# EAGLE design Battery Monitor_V2 (EAGLE 5.07)
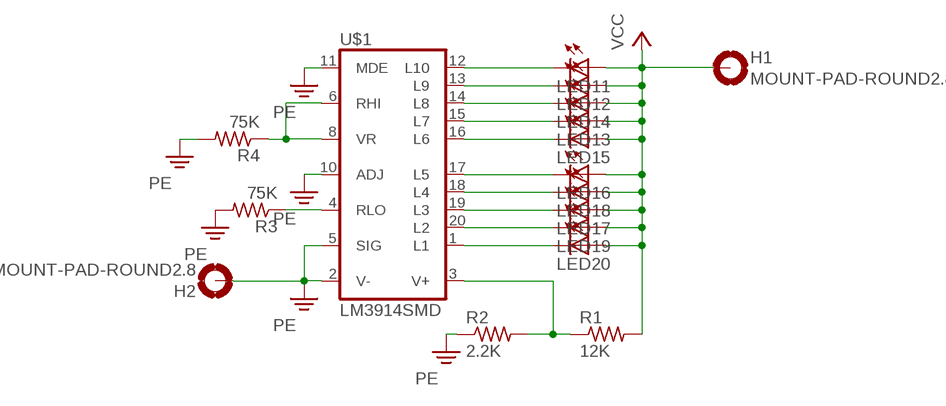
[diagram p0: schematic, sheet 1]

## Parts
H1  MOUNT-PAD-ROUND2.8  [2,8-PAD]
H2  MOUNT-PAD-ROUND2.8  [2,8-PAD]
LED11  LEDCHIP-LED0603  [CHIP-LED0603]
LED12  LEDCHIP-LED0603  [CHIP-LED0603]
LED13  LEDCHIP-LED0603  [CHIP-LED0603]
LED14  LEDCHIP-LED0603  [CHIP-LED0603]
LED15  LEDCHIP-LED0603  [CHIP-LED0603]
LED16  LEDCHIP-LED0603  [CHIP-LED0603]
LED17  LEDCHIP-LED0603  [CHIP-LED0603]
LED18  LEDCHIP-LED0603  [CHIP-LED0603]
LED19  LEDCHIP-LED0603  [CHIP-LED0603]
LED20  LEDCHIP-LED0603  [CHIP-LED0603]
R1  12K  R-US_R0805  [R0805]
R2  2.2K  R-US_R0805  [R0805]
R3  75K  R-US_R0805  [R0805]
R4  75K  R-US_R0805  [R0805]
U$1  LM3914SMD  [PLCC20S]

## Nets
N$1: R1.1 R2.2 U$1.3(V+)
N$2: LED11.C U$1.12(L10)
N$3: LED12.C U$1.13(L9)
N$4: LED14.C U$1.14(L8)
N$5: LED13.C U$1.15(L7)
N$7: LED15.C U$1.16(L6)
N$8: LED16.C U$1.17(L5)
N$9: LED18.C U$1.18(L4)
N$10: LED17.C U$1.19(L3)
N$11: LED19.C U$1.20(L2)
N$12: LED20.C U$1.1(L1)
N$14: R3.1 U$1.4(RLO)
N$15: R4.1 U$1.6(RHI) U$1.8(VR)
PE: H2.B2,8(MOUNT) R2.1 R3.2 R4.2 U$1.2(V-) U$1.5(SIG) U$1.10(ADJ) U$1.11(MDE)
VCC: H1.B2,8(MOUNT) LED11.A LED12.A LED13.A LED14.A LED15.A LED16.A LED17.A LED18.A LED19.A LED20.A R1.2

## Library data of the parts
H1 H2 = holes:MOUNT-PAD-ROUND: MOUNTING PAD, round
LED11-LED20 = led:LED: LED OSRAM: - CHIPLED LG R971, LG N971, LY N971, LG Q971, LY Q971, LO R971, LY R971 LH N974, LH R974 LS Q976, LO Q976, LY Q976 LO Q996 - Hyper CHIPLED LW Q18S LB Q993, LB Q99A, LB R99A - SideLED LS A670, LO A670, LY A670, LG A670, LP A670 LB A673, LV A673, LT A673, LW A673 LH A674 LY A675 LS A676, LA A676, LO A676, LY A676, LW A676 LS A679, LY A679, LG A679 - Hyper Micro SIDELED® LS Y876, LA Y876, LO Y876, LY Y876 LT Y87S - SmartLED LW L88C, LW L88S LB L89C, LB L89S, LG L890 LS L89K, LO L89K, LY L89K LS L896, LA L896, LO L896, LY L896 - TOPLED LS T670, LO T670, LY T670, LG T670, LP T670 LSG T670, LSP T670, LSY T670, LOP T670, LYG T670 LG T671, LOG T671, LSG T671 LB T673, LV T673, LT T673, LW T673 LH T674 LS T676, LA T676, LO T676, LY T676, LB T676, LH T676, LSB T676, LW T676 LB T67C, LV T67C, LT T67C, LS T67K, LO T67K, LY T67K, LW E67C LS E67B, LA E67B, LO E67B, LY E67B, LB E67C, LV E67C, LT E67C LW T67C LS T679, LY T679, LG T679 LS T770, LO T770, LY T770, LG T770, LP T770 LB T773, LV T773, LT T773, LW T773 LH T774 LS E675, LA E675, LY E675, LS T675 LS T776, LA T776, LO T776, LY T776, LB T776 LHGB T686 LT T68C, LB T68C - Hyper Mini TOPLED® LB M676 - Mini TOPLED Santana® LG M470 LS M47K, LO M47K, LY M47K Source: http://www.osram.convergy.de LUXEON: - LUMILED® LXK2-PW12-R00, LXK2-PW12-S00, LXK2-PW14-U00, LXK2-PW14-V00 LXK2-PM12-R00, LXK2-PM12-S00, LXK2-PM14-U00 LXK2-PE12-Q00, LXK2-PE12-R00, LXK2-PE12-S00, LXK2-PE14-T00, LXK2-PE14-U00 LXK2-PB12-K00, LXK2-PB12-L00, LXK2-PB12-M00, LXK2-PB14-N00, LXK2-PB14-P00, LXK2-PB14-Q00 LXK2-PR12-L00, LXK2-PR12-M00, LXK2-PR14-Q00, LXK2-PR14-R00 LXK2-PD12-Q00, LXK2-PD12-R00, LXK2-PD12-S00 LXK2-PH12-R00, LXK2-PH12-S00 LXK2-PL12-P00, LXK2-PL12-Q00, LXK2-PL12-R00 Source: www.luxeon.com KINGBRIGHT: KA-3528ASYC Source: www.kingbright.com
R1-R4 = resistor:R-US_: RESISTOR, American symbol
U$1 = linear:LM3914SMD

## Board
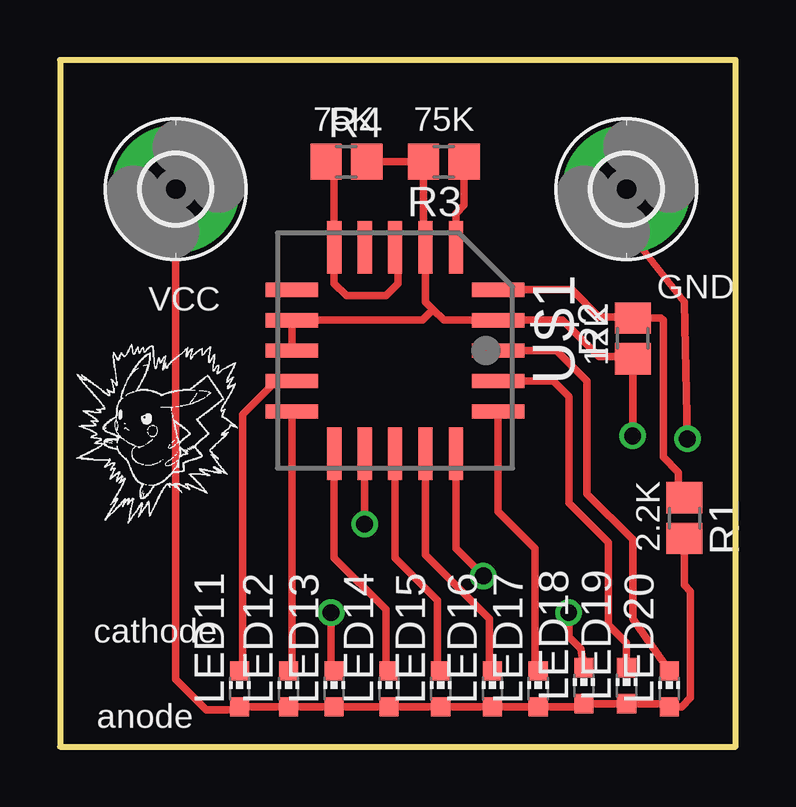
[diagram p1: board, top side]
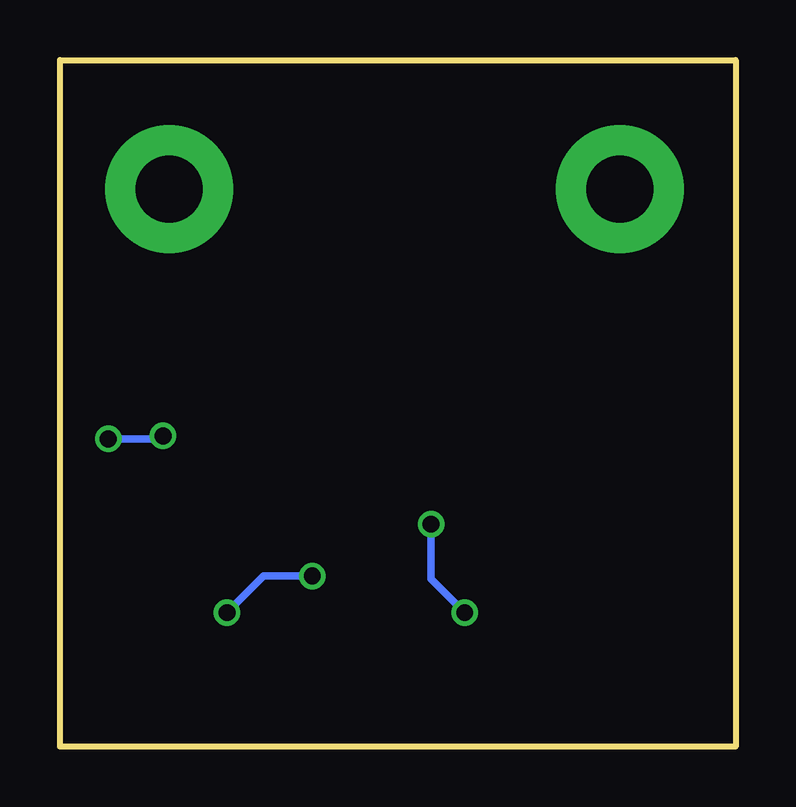
[diagram p2: board, bottom side, seen from below]

Size 28.17 x 28.63 mm. Coordinates in mm from the lower left corner, seen from the top.
Outline: 0,0 28.17,0 28.17,28.63 0,28.63 0,0
Copper layers (1*16): Top 0.035mm / dielectric 1.5mm / Bottom 0.035mm
Design rules "default": minimum track width 10mil, minimum drill 24mil, track to track 8mil, track to pad 8mil, pad to pad 8mil, via to via 8mil, smd to smd 8mil, copper to edge 40mil, drill to drill 8mil, minimum pad ring 10mil, minimum via ring 8mil, stop-mask expansion 4mil, vias tented up to drill 0mil, thermal gap 10mil

### Footprints (pad centres in the part's own frame; a part is rotated, then mirrored left to right if it is on the bottom)
2,8-PAD = drill 2.8 pad 5.334 round: B2,8 0,0
CHIP-LED0603 = smd 0.8 x 0.8: A 0,-0.75; C 0,0.75
R0805 = smd 1.3 x 1.5: 1 -0.85,0; 2 0.85,0
PLCC20S = smd 0.6 x 2.2: 1 0,4.3; 2 -1.27,4.3; 3 -2.54,4.3; 9 -2.54,-4.3; 10 -1.27,-4.3; 11 0,-4.3; 12 1.27,-4.3; 13 2.54,-4.3; 19 2.54,4.3; 20 1.27,4.3 | smd 2.2 x 0.6: 4 -4.3,2.54; 5 -4.3,1.27; 6 -4.3,0; 7 -4.3,-1.27; 8 -4.3,-2.54; 14 4.3,-2.54; 15 4.3,-1.27; 16 4.3,0; 17 4.3,1.27; 18 4.3,2.54

### Placement (x,y rotation side)
H1  4.83,23.24 0 top
H2  23.62,23.24 0 top
LED11  7.49,2.41 0 top
LED12  9.53,2.41 0 top
LED13  11.43,2.41 0 top
LED14  13.72,2.41 0 top
LED15  15.88,2.41 0 top
LED16  18.03,2.41 0 top
LED17  19.94,2.41 0 top
LED18  21.84,2.54 0 top
LED19  23.62,2.54 0 top
LED20  25.4,2.41 0 top
R1  26.04,9.53 270 top
R2  23.88,17.02 90 top
R3  16,24.38 180 top
R4  11.94,24.38 0 top
U$1  13.97,16.51 270 top

### Tracks (layer width: path | path; a pad name or v marks a point on that pad's centre or on a via)
N$1
  Top 0.305: U$1.3 21.34,19.05 22.48,17.91 23.84,17.91 R2.2 25.06,17.87 25.15,17.78 25.15,12.06 25.78,11.43 25.78,10.63 R1.1
N$2
  Top 0.305: U$1.12 9.02,15.24 7.62,13.84 7.62,3.29 LED11.C
N$3
  Top 0.305: U$1.13 9.67,3.31 LED12.C
N$4
  Top 0.305: U$1.14 11.43,7.87 13.59,5.71 13.59,3.29 LED14.C
N$5  (via drill 0.7)
  Top 0.305: v12.7,9.27 U$1.15 | v11.3,5.59 11.3,3.29 LED13.C
  Bottom 0.305: 12.7,9.4 v12.7,9.27 12.7,6.99 v11.3,5.59
N$7
  Top 0.305: U$1.16 13.97,7.87 15.75,6.1 15.75,3.16 LED15.C
N$8
  Top 0.305: U$1.17 15.24,8 17.91,5.33 17.91,3.04 LED16.C
N$9  (via drill 0.7)
  Top 0.305: U$1.18 16.51,8.26 v17.65,7.11 | v21.21,5.59 21.21,4.57 21.72,4.06 LED18.C
  Bottom 0.305: v17.65,7.11 19.68,7.11 v21.21,5.59
N$10
  Top 0.305: U$1.19 18.27,9.8 19.81,8.26 19.81,3.16 LED17.C
N$11
  Top 0.305: U$1.20 20.57,15.24 21.21,14.61 21.21,10.16 22.86,8.51 22.86,5.08 23.62,4.32 LED19.C
N$12
  Top 0.305: U$1.1 20.7,16.51 21.97,15.24 21.97,10.54 23.88,8.64 23.88,5.32 LED20.C
N$14
  Top 0.305: R3.1 16.85,22.57 16.51,22.23 U$1.4
N$15
  Top 0.305: R4.1 11.43,24.04 U$1.8 11.43,19.3 11.94,18.8 13.59,18.8 14.1,19.3 14.1,20.68 U$1.6
PE  (via drill 0.7)
  Top 0.305: R4.2 R3.2 15.15,20.9 U$1.5 15.24,18.54 15.56,18.22 | 15.56,18.22 16,17.78 U$1.2 20.95,17.78 22.48,16.26 23.79,16.26 R2.1 v23.88,12.95 | U$1.11 U$1.10 15.11,17.78 15.56,18.22 | H2.B2,8 23.62,21.59 26.04,18.54 v26.16,12.83
  Bottom 0.305: v26.16,12.83 24,12.83 v23.88,12.95
VCC
  Top 0.305: H1.B2,8 4.83,2.79 6.1,1.52 7.35,1.52 LED11.A LED12.A LED13.A LED14.A LED15.A LED16.A | LED16.A 17.91,1.54 | LED19.A 23.62,1.54 | LED16.A LED17.A 21.72,1.66 LED18.A LED19.A | LED19.A 25.27,1.79 LED20.A 25.92,1.66 26.29,2.03 26.29,6.48 26.04,6.73 R1.2

### Text on the board
tPlace: 75K | 75K | GND | VCC | 12K | 2.2K | cathode | anode